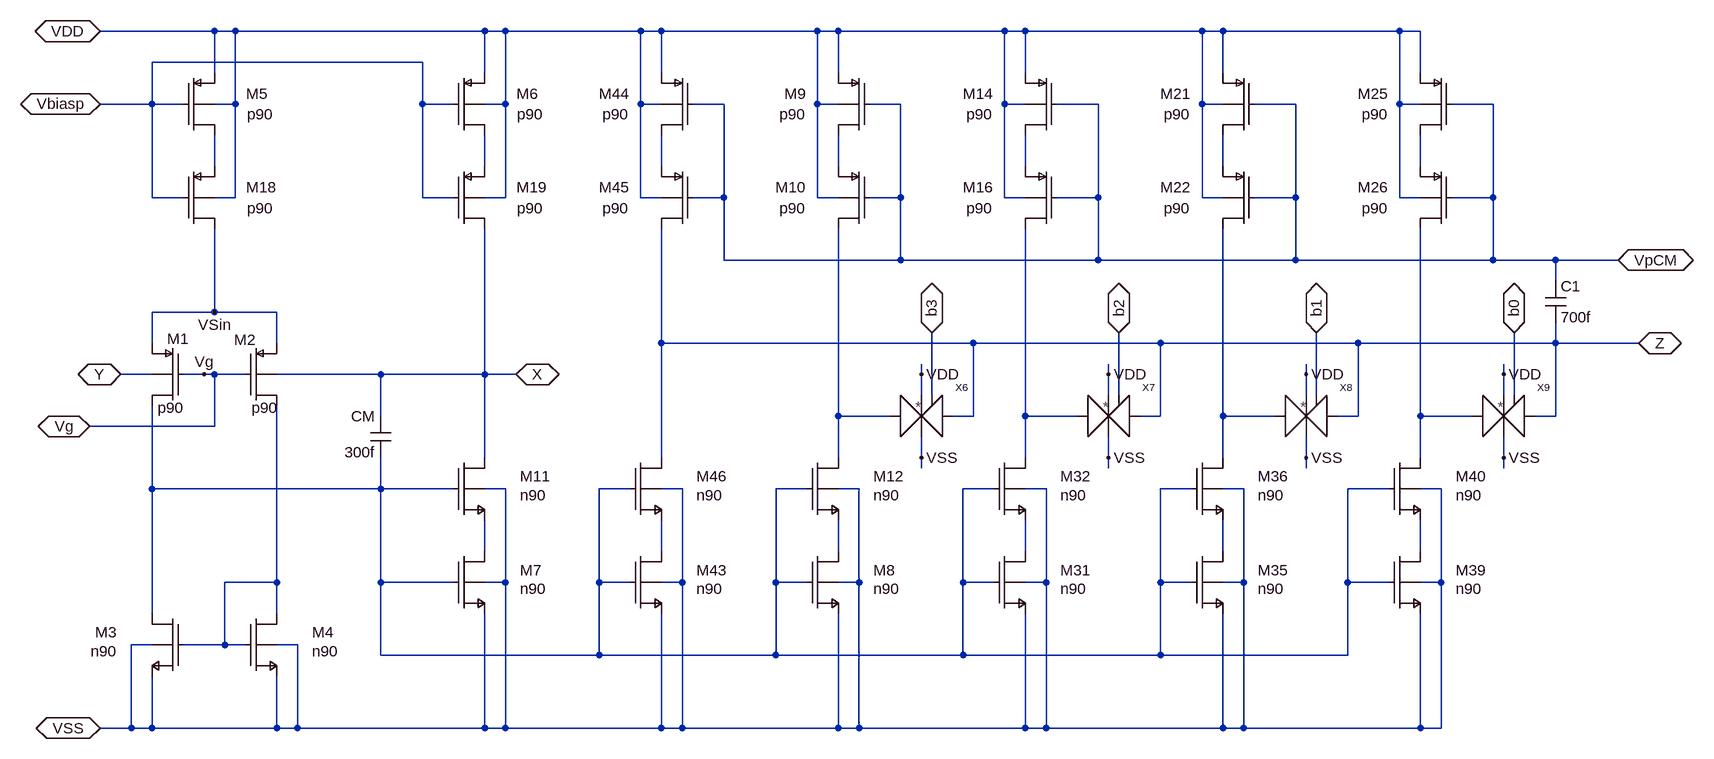
[diagram p0: schematic ccii.asc]
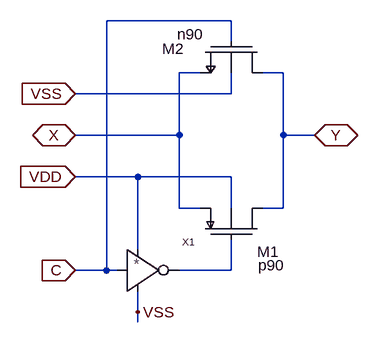
[diagram p1: sub-circuit tgate.asc]
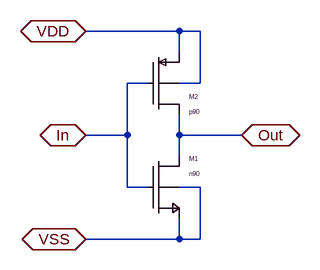
[diagram p2: sub-circuit inv.asc]
ccii.asc, the LTspice schematic file:
Version 4
SHEET 1 1324 1484
WIRE -1968 288 -2144 288
WIRE -1936 288 -1968 288
WIRE -1552 288 -1936 288
WIRE -1520 288 -1552 288
WIRE -1312 288 -1520 288
WIRE -1280 288 -1312 288
WIRE -1040 288 -1280 288
WIRE -1008 288 -1040 288
WIRE -752 288 -1008 288
WIRE -720 288 -752 288
WIRE -448 288 -720 288
WIRE -416 288 -448 288
WIRE -144 288 -416 288
WIRE -112 288 -144 288
WIRE -1648 336 -2064 336
WIRE -1968 352 -1968 288
WIRE -1552 352 -1552 288
WIRE -1280 352 -1280 288
WIRE -1008 352 -1008 288
WIRE -720 352 -720 288
WIRE -416 352 -416 288
WIRE -112 352 -112 288
WIRE -2064 400 -2064 336
WIRE -2064 400 -2144 400
WIRE -2016 400 -2064 400
WIRE -1936 400 -1936 288
WIRE -1936 400 -1968 400
WIRE -1648 400 -1648 336
WIRE -1600 400 -1648 400
WIRE -1520 400 -1520 288
WIRE -1520 400 -1552 400
WIRE -1312 400 -1312 288
WIRE -1280 400 -1312 400
WIRE -1184 400 -1232 400
WIRE -1040 400 -1040 288
WIRE -1008 400 -1040 400
WIRE -912 400 -960 400
WIRE -752 400 -752 288
WIRE -720 400 -752 400
WIRE -608 400 -672 400
WIRE -448 400 -448 288
WIRE -416 400 -448 400
WIRE -304 400 -368 400
WIRE -144 400 -144 288
WIRE -112 400 -144 400
WIRE 0 400 -64 400
WIRE -1968 496 -1968 448
WIRE -1552 496 -1552 448
WIRE -1280 496 -1280 448
WIRE -1008 496 -1008 448
WIRE -720 496 -720 448
WIRE -416 496 -416 448
WIRE -112 496 -112 448
WIRE -2064 544 -2064 400
WIRE -2016 544 -2064 544
WIRE -1936 544 -1936 400
WIRE -1936 544 -1968 544
WIRE -1648 544 -1648 400
WIRE -1600 544 -1648 544
WIRE -1520 544 -1520 400
WIRE -1520 544 -1552 544
WIRE -1312 544 -1312 400
WIRE -1280 544 -1312 544
WIRE -1184 544 -1184 400
WIRE -1184 544 -1232 544
WIRE -1040 544 -1040 400
WIRE -1008 544 -1040 544
WIRE -912 544 -912 400
WIRE -912 544 -960 544
WIRE -752 544 -752 400
WIRE -720 544 -752 544
WIRE -608 544 -608 400
WIRE -608 544 -672 544
WIRE -448 544 -448 400
WIRE -416 544 -448 544
WIRE -304 544 -304 400
WIRE -304 544 -368 544
WIRE -144 544 -144 400
WIRE -112 544 -144 544
WIRE 0 544 0 400
WIRE 0 544 -64 544
WIRE -1184 640 -1184 544
WIRE -912 640 -912 544
WIRE -912 640 -1184 640
WIRE -608 640 -608 544
WIRE -608 640 -912 640
WIRE -304 640 -304 544
WIRE -304 640 -608 640
WIRE 0 640 0 544
WIRE 0 640 -304 640
WIRE 96 640 0 640
WIRE 192 640 96 640
WIRE 96 672 96 640
WIRE -1968 720 -1968 592
WIRE -1968 720 -2064 720
WIRE -1872 720 -1968 720
WIRE -2064 768 -2064 720
WIRE -1872 768 -1872 720
WIRE -1280 768 -1280 592
WIRE -800 768 -1280 768
WIRE -512 768 -800 768
WIRE -208 768 -512 768
WIRE 96 768 96 736
WIRE 96 768 -208 768
WIRE 224 768 96 768
WIRE -2064 816 -2112 816
WIRE -1984 816 -2016 816
WIRE -1968 816 -1984 816
WIRE -1920 816 -1968 816
WIRE -1712 816 -1872 816
WIRE -1552 816 -1552 592
WIRE -1552 816 -1712 816
WIRE -1504 816 -1552 816
WIRE -880 816 -880 800
WIRE -592 816 -592 800
WIRE -288 816 -288 800
WIRE 16 816 16 800
WIRE -880 848 -880 816
WIRE -864 848 -864 752
WIRE -592 848 -592 816
WIRE -576 848 -576 752
WIRE -288 848 -288 816
WIRE -272 848 -272 752
WIRE 16 848 16 816
WIRE 32 848 32 752
WIRE -1712 880 -1712 816
WIRE -1008 880 -1008 592
WIRE -928 880 -1008 880
WIRE -800 880 -800 768
WIRE -800 880 -832 880
WIRE -720 880 -720 592
WIRE -640 880 -720 880
WIRE -512 880 -512 768
WIRE -512 880 -544 880
WIRE -416 880 -416 592
WIRE -336 880 -416 880
WIRE -208 880 -208 768
WIRE -208 880 -240 880
WIRE -112 880 -112 592
WIRE -32 880 -112 880
WIRE 96 880 96 768
WIRE 96 880 64 880
WIRE -1968 896 -1968 816
WIRE -1968 896 -2160 896
WIRE -1552 944 -1552 816
WIRE -1280 944 -1280 768
WIRE -1008 944 -1008 880
WIRE -880 944 -880 912
WIRE -720 944 -720 880
WIRE -592 944 -592 912
WIRE -416 944 -416 880
WIRE -288 944 -288 912
WIRE -112 944 -112 880
WIRE 16 944 16 912
WIRE -880 960 -880 944
WIRE -592 960 -592 944
WIRE -288 960 -288 944
WIRE 16 960 16 944
WIRE -2064 992 -2064 864
WIRE -1712 992 -1712 944
WIRE -1712 992 -2064 992
WIRE -1600 992 -1712 992
WIRE -1520 992 -1552 992
WIRE -1328 992 -1376 992
WIRE -1248 992 -1280 992
WIRE -1056 992 -1104 992
WIRE -976 992 -1008 992
WIRE -768 992 -816 992
WIRE -688 992 -720 992
WIRE -464 992 -512 992
WIRE -384 992 -416 992
WIRE -160 992 -224 992
WIRE -80 992 -112 992
WIRE -1552 1088 -1552 1040
WIRE -1280 1088 -1280 1040
WIRE -1008 1088 -1008 1040
WIRE -720 1088 -720 1040
WIRE -416 1088 -416 1040
WIRE -112 1088 -112 1040
WIRE -1872 1136 -1872 864
WIRE -1872 1136 -1952 1136
WIRE -1712 1136 -1712 992
WIRE -1600 1136 -1712 1136
WIRE -1520 1136 -1520 992
WIRE -1520 1136 -1552 1136
WIRE -1376 1136 -1376 992
WIRE -1328 1136 -1376 1136
WIRE -1248 1136 -1248 992
WIRE -1248 1136 -1280 1136
WIRE -1104 1136 -1104 992
WIRE -1056 1136 -1104 1136
WIRE -976 1136 -976 992
WIRE -976 1136 -1008 1136
WIRE -816 1136 -816 992
WIRE -768 1136 -816 1136
WIRE -688 1136 -688 992
WIRE -688 1136 -720 1136
WIRE -512 1136 -512 992
WIRE -464 1136 -512 1136
WIRE -384 1136 -384 992
WIRE -384 1136 -416 1136
WIRE -224 1136 -224 992
WIRE -160 1136 -224 1136
WIRE -80 1136 -80 992
WIRE -80 1136 -112 1136
WIRE -2064 1184 -2064 992
WIRE -1872 1184 -1872 1136
WIRE -2064 1232 -2096 1232
WIRE -1952 1232 -1952 1136
WIRE -1952 1232 -2016 1232
WIRE -1920 1232 -1952 1232
WIRE -1840 1232 -1872 1232
WIRE -1712 1248 -1712 1136
WIRE -1376 1248 -1376 1136
WIRE -1376 1248 -1712 1248
WIRE -1104 1248 -1104 1136
WIRE -1104 1248 -1376 1248
WIRE -816 1248 -816 1136
WIRE -816 1248 -1104 1248
WIRE -512 1248 -512 1136
WIRE -512 1248 -816 1248
WIRE -224 1248 -224 1136
WIRE -224 1248 -512 1248
WIRE -2096 1360 -2096 1232
WIRE -2096 1360 -2144 1360
WIRE -2064 1360 -2064 1280
WIRE -2064 1360 -2096 1360
WIRE -1872 1360 -1872 1280
WIRE -1872 1360 -2064 1360
WIRE -1840 1360 -1840 1232
WIRE -1840 1360 -1872 1360
WIRE -1552 1360 -1552 1184
WIRE -1552 1360 -1840 1360
WIRE -1520 1360 -1520 1136
WIRE -1520 1360 -1552 1360
WIRE -1280 1360 -1280 1184
WIRE -1280 1360 -1520 1360
WIRE -1248 1360 -1248 1136
WIRE -1248 1360 -1280 1360
WIRE -1008 1360 -1008 1184
WIRE -1008 1360 -1248 1360
WIRE -976 1360 -976 1136
WIRE -976 1360 -1008 1360
WIRE -720 1360 -720 1184
WIRE -720 1360 -976 1360
WIRE -688 1360 -688 1136
WIRE -688 1360 -720 1360
WIRE -416 1360 -416 1184
WIRE -416 1360 -688 1360
WIRE -384 1360 -384 1136
WIRE -384 1360 -416 1360
WIRE -112 1360 -112 1184
WIRE -112 1360 -384 1360
WIRE -80 1360 -80 1136
WIRE -80 1360 -112 1360
FLAG -1984 816 Vg
FLAG -1968 720 VSin
FLAG -2144 288 VDD
IOPIN -2144 288 BiDir
FLAG -2144 400 Vbiasp
IOPIN -2144 400 BiDir
FLAG -2112 816 Y
IOPIN -2112 816 BiDir
FLAG -2144 1360 VSS
IOPIN -2144 1360 BiDir
FLAG 224 768 Z
IOPIN 224 768 BiDir
FLAG -2160 896 Vg
IOPIN -2160 896 BiDir
FLAG 192 640 VpCM
IOPIN 192 640 BiDir
FLAG -1504 816 X
IOPIN -1504 816 BiDir
FLAG -864 752 b3
IOPIN -864 752 BiDir
FLAG -576 752 b2
IOPIN -576 752 BiDir
FLAG -272 752 b1
IOPIN -272 752 BiDir
FLAG 32 752 b0
IOPIN 32 752 BiDir
FLAG -880 816 VDD
FLAG -880 944 VSS
FLAG -592 816 VDD
FLAG -592 944 VSS
FLAG -288 816 VDD
FLAG -288 944 VSS
FLAG 16 816 VDD
FLAG 16 944 VSS
SYMBOL pmosb -1920 768 R0
WINDOW 0 -18 -5 Left 0
WINDOW 3 9 99 Left 0
SYMATTR InstName M2
SYMATTR Value p90
SYMATTR Value2 l=0.5u w=37.9u m=2
SYMBOL nmosb -1920 1184 R0
WINDOW 0 102 29 Left 0
WINDOW 3 102 58 Left 0
WINDOW 39 65 55 Left 0
SYMATTR InstName M4
SYMATTR Value n90
SYMATTR Value2 l=0.5u w=7.9u m=1
SYMBOL pmosb -2016 768 M0
WINDOW 0 -9 -7 Left 0
WINDOW 3 -1 99 Left 0
SYMATTR InstName M1
SYMATTR Value p90
SYMATTR Value2 l=0.5u w=37.9u m=2
SYMBOL nmosb -2016 1184 M0
WINDOW 0 102 29 Left 0
WINDOW 3 102 58 Left 0
WINDOW 39 65 55 Left 0
SYMATTR InstName M3
SYMATTR Value n90
SYMATTR Value2 l=0.5u w=7.9u m=1
SYMBOL pmosb -2016 352 R0
WINDOW 0 97 32 Left 0
WINDOW 3 98 64 Left 0
SYMATTR InstName M5
SYMATTR Value p90
SYMATTR Value2 l=0.5u w=6.6u m=8
SYMBOL nmosb -1600 1088 R0
WINDOW 0 102 29 Left 0
WINDOW 3 102 58 Left 0
WINDOW 39 65 55 Left 0
SYMATTR InstName M7
SYMATTR Value n90
SYMATTR Value2 l=0.5u w=14.4u m=1
SYMBOL pmosb -1600 352 R0
WINDOW 0 97 32 Left 0
WINDOW 3 98 64 Left 0
SYMATTR InstName M6
SYMATTR Value p90
SYMATTR Value2 l=0.5u w=6.6u m=9
SYMBOL cap -1696 944 R180
WINDOW 0 24 64 Left 0
WINDOW 3 24 8 Left 0
SYMATTR InstName CM
SYMATTR Value 300f
SYMBOL pmosb -2016 496 R0
WINDOW 0 97 32 Left 0
WINDOW 3 98 64 Left 0
SYMATTR InstName M18
SYMATTR Value p90
SYMATTR Value2 l=0.25u w=33u m=8
SYMBOL pmosb -1600 496 R0
WINDOW 0 97 32 Left 0
WINDOW 3 98 64 Left 0
SYMATTR InstName M19
SYMATTR Value p90
SYMATTR Value2 l=0.25u w=33u m=9
SYMBOL nmosb -1056 1088 R0
WINDOW 0 102 29 Left 0
WINDOW 3 102 58 Left 0
WINDOW 39 65 55 Left 0
SYMATTR InstName M8
SYMATTR Value n90
SYMATTR Value2 l=0.5u w=7.2u m=1
SYMBOL pmosb -960 352 M0
WINDOW 0 97 32 Left 0
WINDOW 3 98 64 Left 0
SYMATTR InstName M9
SYMATTR Value p90
SYMATTR Value2 l=0.5u w=3.28u m=9
SYMBOL pmosb -960 496 M0
WINDOW 0 97 32 Left 0
WINDOW 3 98 64 Left 0
SYMATTR InstName M10
SYMATTR Value p90
SYMATTR Value2 l=0.25u w=16.48u m=9
SYMBOL nmosb -1600 944 R0
WINDOW 0 102 29 Left 0
WINDOW 3 102 58 Left 0
WINDOW 39 65 55 Left 0
SYMATTR InstName M11
SYMATTR Value n90
SYMATTR Value2 l=0.25u w=21.6u m=1
SYMBOL nmosb -1056 944 R0
WINDOW 0 102 29 Left 0
WINDOW 3 102 58 Left 0
WINDOW 39 65 55 Left 0
SYMATTR InstName M12
SYMATTR Value n90
SYMATTR Value2 l=0.25u w=10.8u m=1
SYMBOL cap 80 672 R0
SYMATTR InstName C1
SYMATTR Value 700f
SYMBOL pmosb -672 352 M0
WINDOW 0 97 32 Left 0
WINDOW 3 98 64 Left 0
SYMATTR InstName M14
SYMATTR Value p90
SYMATTR Value2 l=0.5u w=1.64u m=9
SYMBOL pmosb -672 496 M0
WINDOW 0 97 32 Left 0
WINDOW 3 98 64 Left 0
SYMATTR InstName M16
SYMATTR Value p90
SYMATTR Value2 l=0.25u w=8.24u m=9
SYMBOL pmosb -368 352 M0
WINDOW 0 97 32 Left 0
WINDOW 3 98 64 Left 0
SYMATTR InstName M21
SYMATTR Value p90
SYMATTR Value2 l=0.5u w=0.82u m=9
SYMBOL pmosb -368 496 M0
WINDOW 0 97 32 Left 0
WINDOW 3 98 64 Left 0
SYMATTR InstName M22
SYMATTR Value p90
SYMATTR Value2 l=0.25u w=4.12u m=9
SYMBOL pmosb -64 352 M0
WINDOW 0 97 32 Left 0
WINDOW 3 98 64 Left 0
SYMATTR InstName M25
SYMATTR Value p90
SYMATTR Value2 l=0.5u w=0.41u m=9
SYMBOL pmosb -64 496 M0
WINDOW 0 97 32 Left 0
WINDOW 3 98 64 Left 0
SYMATTR InstName M26
SYMATTR Value p90
SYMATTR Value2 l=0.25u w=2.06u m=9
SYMBOL nmosb -768 1088 R0
WINDOW 0 102 29 Left 0
WINDOW 3 102 58 Left 0
WINDOW 39 65 55 Left 0
SYMATTR InstName M31
SYMATTR Value n90
SYMATTR Value2 l=0.5u w=3.6u m=1
SYMBOL nmosb -768 944 R0
WINDOW 0 102 29 Left 0
WINDOW 3 102 58 Left 0
WINDOW 39 65 55 Left 0
SYMATTR InstName M32
SYMATTR Value n90
SYMATTR Value2 l=0.25u w=5.4u m=1
SYMBOL nmosb -464 1088 R0
WINDOW 0 102 29 Left 0
WINDOW 3 102 58 Left 0
WINDOW 39 65 55 Left 0
SYMATTR InstName M35
SYMATTR Value n90
SYMATTR Value2 l=0.5u w=1.8u m=1
SYMBOL nmosb -464 944 R0
WINDOW 0 102 29 Left 0
WINDOW 3 102 58 Left 0
WINDOW 39 65 55 Left 0
SYMATTR InstName M36
SYMATTR Value n90
SYMATTR Value2 l=0.25u w=2.7u m=1
SYMBOL nmosb -160 1088 R0
WINDOW 0 102 29 Left 0
WINDOW 3 102 58 Left 0
WINDOW 39 65 55 Left 0
SYMATTR InstName M39
SYMATTR Value n90
SYMATTR Value2 l=0.5u w=0.9u m=1
SYMBOL nmosb -160 944 R0
WINDOW 0 102 29 Left 0
WINDOW 3 102 58 Left 0
WINDOW 39 65 55 Left 0
SYMATTR InstName M40
SYMATTR Value n90
SYMATTR Value2 l=0.25u w=1.35u m=1
SYMBOL nmosb -1328 1088 R0
WINDOW 0 102 29 Left 0
WINDOW 3 102 58 Left 0
WINDOW 39 65 55 Left 0
SYMATTR InstName M43
SYMATTR Value n90
SYMATTR Value2 l=0.5u w=14.4u m=1
SYMBOL pmosb -1232 352 M0
WINDOW 0 97 32 Left 0
WINDOW 3 98 64 Left 0
SYMATTR InstName M44
SYMATTR Value p90
SYMATTR Value2 l=0.5u w=6.6u m=9
SYMBOL pmosb -1232 496 M0
WINDOW 0 97 32 Left 0
WINDOW 3 98 64 Left 0
SYMATTR InstName M45
SYMATTR Value p90
SYMATTR Value2 l=0.25u w=33u m=9
SYMBOL nmosb -1328 944 R0
WINDOW 0 102 29 Left 0
WINDOW 3 102 58 Left 0
WINDOW 39 65 55 Left 0
SYMATTR InstName M46
SYMATTR Value n90
SYMATTR Value2 l=0.25u w=21.6u m=1
SYMBOL tgate -912 848 R0
SYMATTR InstName X6
SYMBOL tgate -624 848 R0
SYMATTR InstName X7
SYMBOL tgate -320 848 R0
SYMATTR InstName X8
SYMBOL tgate -16 848 R0
SYMATTR InstName X9

tgate.asc, the sub-circuit schematic file:
Version 4
SHEET 1 904 704
WIRE 336 0 144 0
WIRE 336 32 336 0
WIRE 288 80 256 80
WIRE 416 80 384 80
WIRE 336 112 336 80
WIRE 336 112 96 112
WIRE 256 176 256 80
WIRE 256 176 96 176
WIRE 416 176 416 80
WIRE 464 176 416 176
WIRE 192 240 96 240
WIRE 336 240 192 240
WIRE 256 288 256 176
WIRE 288 288 256 288
WIRE 336 288 336 240
WIRE 416 288 416 176
WIRE 416 288 384 288
WIRE 192 352 192 240
WIRE 144 384 144 0
WIRE 144 384 96 384
WIRE 160 384 144 384
WIRE 336 384 336 336
WIRE 336 384 256 384
WIRE 192 448 192 416
WIRE 192 464 192 448
FLAG 96 176 X
IOPIN 96 176 BiDir
FLAG 464 176 Y
IOPIN 464 176 BiDir
FLAG 96 240 VDD
IOPIN 96 240 In
FLAG 96 384 C
IOPIN 96 384 In
FLAG 96 112 VSS
IOPIN 96 112 In
FLAG 192 448 VSS
SYMBOL pmosb 288 336 R270
WINDOW 0 -19 88 VRight 0
WINDOW 3 -40 89 VRight 0
SYMATTR InstName M1
SYMATTR Value p90
SYMATTR Value2 l=0.25u w=20u m=10
SYMBOL nmosb 384 32 R90
WINDOW 0 11 121 VRight 0
WINDOW 3 -11 91 VRight 0
SYMATTR InstName M2
SYMATTR Value n90
SYMATTR Value2 l=0.25u w=10u m=10
SYMBOL inv 176 336 R0
SYMATTR InstName X1

inv.asc, the sub-circuit schematic file:
Version 4
SHEET 1 880 680
WIRE 192 16 48 16
WIRE 224 16 192 16
WIRE 192 48 192 16
WIRE 144 96 112 96
WIRE 224 96 224 16
WIRE 224 96 192 96
WIRE 112 176 112 96
WIRE 112 176 48 176
WIRE 192 176 192 144
WIRE 288 176 192 176
WIRE 192 208 192 176
WIRE 112 256 112 176
WIRE 144 256 112 256
WIRE 224 256 192 256
WIRE 192 336 192 304
WIRE 192 336 48 336
WIRE 224 336 224 256
WIRE 224 336 192 336
FLAG 48 16 VDD
IOPIN 48 16 BiDir
FLAG 48 336 VSS
IOPIN 48 336 BiDir
FLAG 48 176 In
IOPIN 48 176 BiDir
FLAG 288 176 Out
IOPIN 288 176 BiDir
SYMBOL nmosb 144 208 R0
SYMATTR InstName M1
SYMATTR Value n90
SYMATTR Value2 l=0.25u w=2u m=1
SYMBOL pmosb 144 48 R0
SYMATTR InstName M2
SYMATTR Value p90
SYMATTR Value2 l=0.25u w=4u m=1

The netlist it stands for:
* ccii.asc
M2 N019 Vg VSin X p90 l=0.5u w=37.9u m=2
M4 N019 N019 VSS VSS n90 l=0.5u w=7.9u m=1
M1 N012 Vg VSin Y p90 l=0.5u w=37.9u m=2
M3 N012 N019 VSS VSS n90 l=0.5u w=7.9u m=1
M5 N001 Vbiasp VDD VDD p90 l=0.5u w=6.6u m=8
M7 N013 N012 VSS VSS n90 l=0.5u w=14.4u m=1
M6 N002 Vbiasp VDD VDD p90 l=0.5u w=6.6u m=9
CM N012 X 300f
M18 VSin Vbiasp N001 VDD p90 l=0.25u w=33u m=8
M19 X Vbiasp N002 VDD p90 l=0.25u w=33u m=9
M8 N015 N012 VSS VSS n90 l=0.5u w=7.2u m=1
M9 N004 VpCM VDD VDD p90 l=0.5u w=3.28u m=9
M10 N008 VpCM N004 VDD p90 l=0.25u w=16.48u m=9
M11 X N012 N013 VSS n90 l=0.25u w=21.6u m=1
M12 N008 N012 N015 VSS n90 l=0.25u w=10.8u m=1
C1 VpCM Z 700f
M14 N005 VpCM VDD VDD p90 l=0.5u w=1.64u m=9
M16 N009 VpCM N005 VDD p90 l=0.25u w=8.24u m=9
M21 N006 VpCM VDD VDD p90 l=0.5u w=0.82u m=9
M22 N010 VpCM N006 VDD p90 l=0.25u w=4.12u m=9
M25 N007 VpCM VDD VDD p90 l=0.5u w=0.41u m=9
M26 N011 VpCM N007 VDD p90 l=0.25u w=2.06u m=9
M31 N016 N012 VSS VSS n90 l=0.5u w=3.6u m=1
M32 N009 N012 N016 VSS n90 l=0.25u w=5.4u m=1
M35 N017 N012 VSS VSS n90 l=0.5u w=1.8u m=1
M36 N010 N012 N017 VSS n90 l=0.25u w=2.7u m=1
M39 N018 N012 VSS VSS n90 l=0.5u w=0.9u m=1
M40 N011 N012 N018 VSS n90 l=0.25u w=1.35u m=1
M43 N014 N012 VSS VSS n90 l=0.5u w=14.4u m=1
M44 N003 VpCM VDD VDD p90 l=0.5u w=6.6u m=9
M45 Z VpCM N003 VDD p90 l=0.25u w=33u m=9
M46 Z N012 N014 VSS n90 l=0.25u w=21.6u m=1
XX6 N008 Z VDD VSS b3 tgate
XX7 N009 Z VDD VSS b2 tgate
XX8 N010 Z VDD VSS b1 tgate
XX9 N011 Z VDD VSS b0 tgate

* block symbol definitions
.subckt tgate X Y VDD VSS C
M1 Y N001 X VDD p90 l=0.25u w=20u m=10
M2 Y C X VSS n90 l=0.25u w=10u m=10
XX1 C VDD N001 VSS inv
.ends tgate

.subckt inv In VDD Out VSS
M1 Out In VSS VSS n90 l=0.25u w=2u m=1
M2 Out In VDD VDD p90 l=0.25u w=4u m=1
.ends inv

.model NMOS NMOS
.model PMOS PMOS
.lib standard.mos
.backanno
.end